# Altium project SFCRS232.PrjPCB
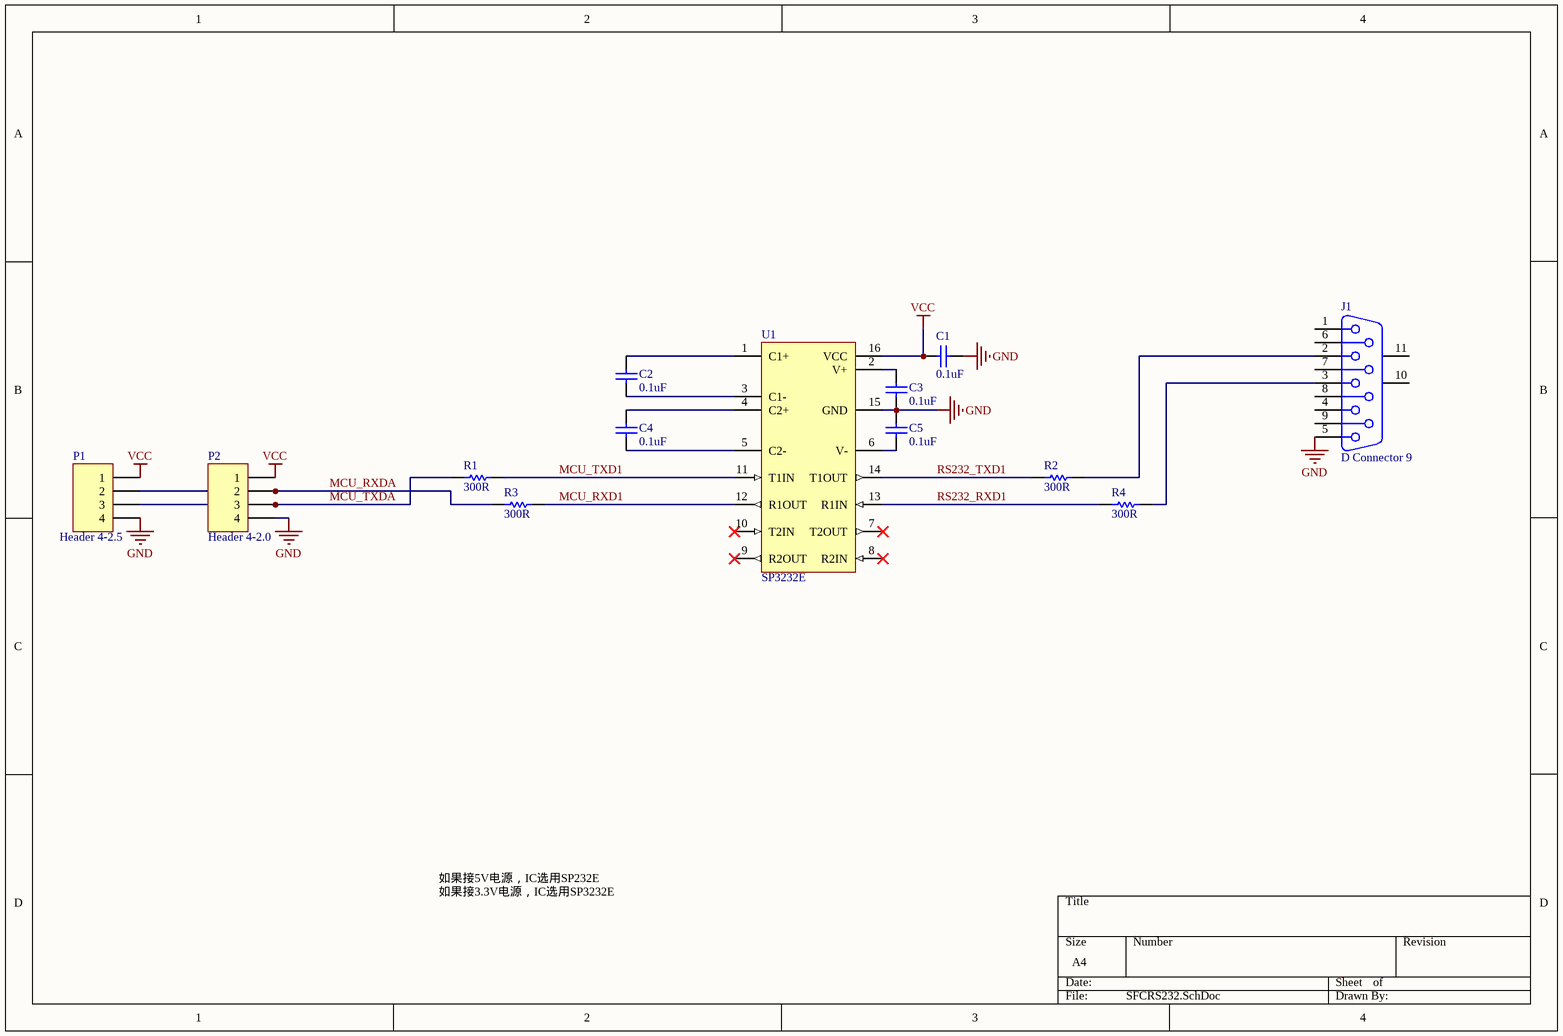
[diagram p0: SFCRS232.SchDoc]
1 sheet, 13 parts. Net scope: global (net labels, ports and power ports of the same name join across sheets).
Board file: SFCRS232.PcbDoc

## Sheet SFCRS232.SchDoc
size A4

### Parts
C1  0.1uF  [CAPC2012M]
C2  0.1uF  [CAPC2012M]
C3  0.1uF  [CAPC2012M]
C4  0.1uF  [CAPC2012M]
C5  0.1uF  [CAPC2012M]
J1  D Connector 9  [DB9-M]
P1  Header 4-2.5  [HDR1X4-2.5]
P2  Header 4-2.0  [HDR1X4-2.0]
R1  300R  [RESC2012M]
R2  300R  [RESC2012M]
R3  300R  [RESC2012M]
R4  300R  [RESC2012M]
U1  SP3232E  [NSO16_M]

### Nets
GND: C1.1 C3.2 C5.1 J1.5 P1.4 P2.4 U1.15(GND)
VCC: C1.2 P1.1 P2.1 U1.16(VCC)
MCU_RXD1: R3.2 U1.12(R1OUT)
MCU_RXDA: P1.2 P2.2 R3.1
MCU_TXD1: R1.2 U1.11(T1IN)
MCU_TXDA: P1.3 P2.3 R1.1
RS232_RXD1: R4.1 U1.13(R1IN)
RS232_TXD1: R2.1 U1.14(T1OUT)
NetC2_1: C2.1 U1.3(C1-)
NetC2_2: C2.2 U1.1(C1+)
NetC3_1: C3.1 U1.2(V+)
NetC4_1: C4.1 U1.5(C2-)
NetC4_2: C4.2 U1.4(C2+)
NetC5_2: C5.2 U1.6(V-)
NetJ1_2: J1.2 R2.2
NetJ1_3: J1.3 R4.2

Not connected (* = marked no-connect by the designer): J1 1 4 6 7 8 9 10(MH1) 11(MH2); U1 7(T2OUT)* 8(R2IN)* 9(R2OUT)* 10(T2IN)*

### Notes on the sheet
- 如果接5V电源，IC选用SP232E
  如果接3.3V电源，IC选用SP3232E

### Library data of the parts
C1-C5 = Cap: Capacitor; Value: 1nF; Published: 8-Jun-2000; LatestRevisionDate: 17-Jul-2002; LatestRevisionNote: Re-released for DXP Platform.; PackageReference: RAD-0.3; Publisher: Altium Limited
J1 = D Connector 9: 串口; PackageDocument: O; Positions: 9; Gender: Receptacle; Published: 15-Jun-2001; LatestRevisionDate: 17-Jul-2002; LatestRevisionNote: Re-released for DXP Platform.; DatasheetDocument: 1-Sep-1999; PackageReference: 788750; Publisher: Altium Limited; Orientation: Right Angle
P1 P2 = Header 4: Header, 4-Pin; LatestRevisionDate: 17-Jul-2002; LatestRevisionNote: Re-released for DXP Platform.; Publisher: Altium Limited
R1-R4 = Res1: Resistor; Value: 10K; Published: 8-Jun-2000; LatestRevisionDate: 17-Jul-2002; LatestRevisionNote: Re-released for DXP Platform.; PackageReference: AXIAL-0.3; Publisher: Altium Limited
U1 = SP3232E: +3.0V+5V Powered, Multi-Channel RS-232 Driver/Receiver; Published: 16-Jan-2001; LatestRevisionDate: 13-Apr-2006; LatestRevisionNote: IPC-7351 Footprint Added.; PackageReference: NSO16; Publisher: Altium Limited; PackageDescription: 16-Pin Small Outline Integrated Circuit 1.27 mm Pitch; Code_JEDEC: MS-012-AC; Code_IPC: SOIC127P600-16; ComponentLink1Description: Manufacturer Link; ComponentLink1URL: http://www.maxim-ic.com/; ComponentLink2Description: Datasheet; ComponentLink2URL: http://pdfserv.maxim-ic.com/en/ds/MAX220-MAX249.pdf